# Altium schematic sheet main.SchDoc: Top Level
size A4; DrawnBy: J. Reimer T. Yeung M. Hirole; Organization: UTAT SS; DocumentNumber: 1; Revision: 1.0; SheetNumber: 1; SheetTotal: 17
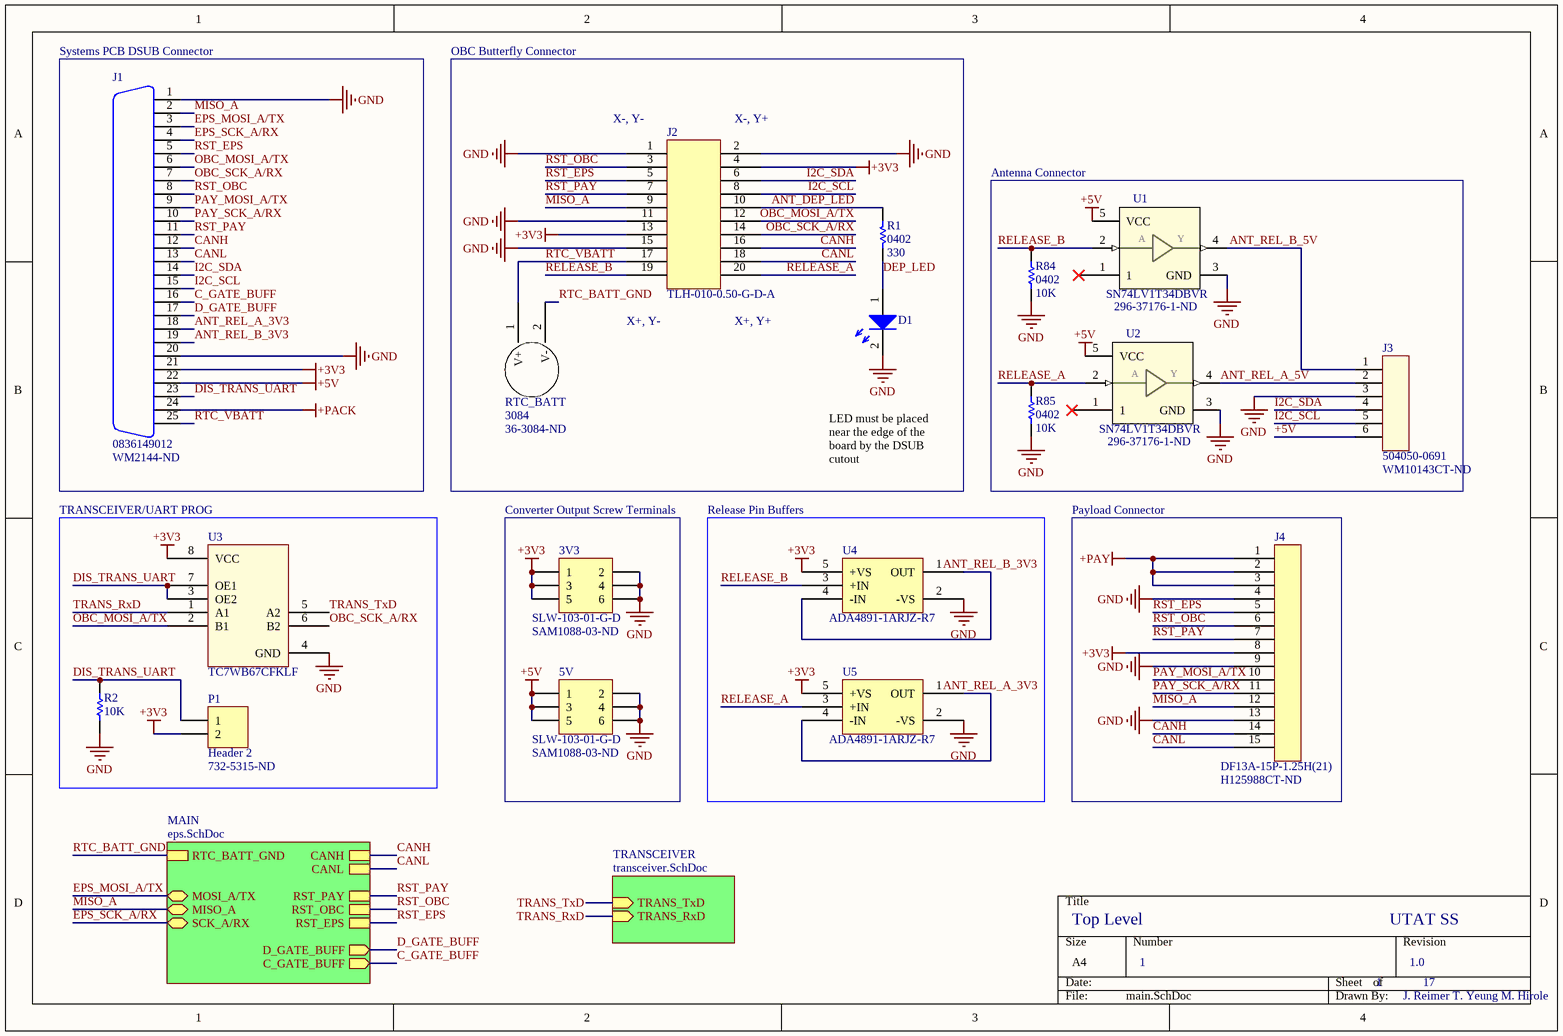
[diagram p0: main.SchDoc]

## Parts
3V3  SLW-103-01-G-D  Supplier Part Number 1: SAM1088-03-ND  [SLW-103-01-X-D]
5V  SLW-103-01-G-D  Supplier Part Number 1: SAM1088-03-ND  [SLW-103-01-X-D]
D1  (no value)  [LED0603]
J1  0836149012  Supplier Part Number 1: WM2144-ND  [0836149012]
J2  TLH-010-0.50-G-D-A  [TLH-010-0.50-G-D-A]
J3  504050-0691  Supplier Part Number 1: WM10143CT-ND  [MOLEX_504050-0691]
J4  DF13A-15P-1.25H(21)  Supplier Part Number 1: H125988CT-ND  [DF13A-15P-1.25H(21)]
P1  Header 2  Supplier Part Number 1: 732-5315-ND  [HDR1X2]
R1  0402  value 330  [RES0402R]
R2  value 10K  [RES0402R]  (hidden comment: 0402)
R84  0402  value 10K  [RES0402R]
R85  0402  value 10K  [RES0402R]
RTC_BATT  3084  Supplier Part Number 1: 36-3084-ND  [3084]
U1  SN74LV1T34DBVR  Supplier Part Number 1: 296-37176-1-ND  [SOT95P280X145-5N]
U2  SN74LV1T34DBVR  Supplier Part Number 1: 296-37176-1-ND  [SOT95P280X145-5N]
U3  TC7WB67CFKLF  [US8]
U4  ADA4891-1ARJZ-R7  [SOT-23-5]
U5  ADA4891-1ARJZ-R7  [SOT-23-5]

## Blocks framed on the sheet
Systems PCB DSUB Connector: J1
Antenna Connector: J3 R84 R85 U1 U2
TRANSCEIVER/UART PROG: P1 R2 U3
Converter Output Screw Terminals: 3V3 5V
Release Pin Buffers: U4 U5
Payload Connector: J4

## Sub-sheets
MAIN = eps.SchDoc: RST_PAY, RST_OBC, RST_EPS, SCK_A/RX (bidir), MOSI_A/TX (bidir), MISO_A (bidir), CANL, CANH, RTC_BATT_GND, D_GATE_BUFF (out), C_GATE_BUFF (out)
TRANSCEIVER = transceiver.SchDoc: TRANS_RxD (in), TRANS_TxD (in)

## Nets
+3V3: 3V3.1 3V3.3 3V3.5 J1.21 J2.4 J2.13 J4.8 P1.2 U3.8(VCC) U4.5(+VS) U5.5(+VS)
+5V: 5V.1 5V.3 5V.5 J1.22 J3.6 U1.5(VCC) U2.5(VCC)
+PACK: J1.24
+PAY: J4.1 J4.2 J4.3
GND: 3V3.2 3V3.4 3V3.6 5V.2 5V.4 5V.6 D1.2 J1.1 J1.20 J2.1 J2.2 J2.11 J2.15 J3.3 J4.4 J4.9 J4.13 R2.2 R84.1 R85.1 U1.3(GND) U2.3(GND) U3.4(GND) U4.2(-VS) U5.2(-VS)
ANT_DEP_LED: J2.10 R1.2
ANT_REL_A_3V3: J1.18 U5.1(OUT) U5.4(-IN)
ANT_REL_A_5V: J3.2 U2.4(Y)
ANT_REL_B_3V3: J1.19 U4.1(OUT) U4.4(-IN)
ANT_REL_B_5V: J3.1 U1.4(Y)
C_GATE_BUFF: J1.16 ; sheet MAIN/C_GATE_BUFF
CANH: J1.12 J2.16 J4.14 ; sheet MAIN/CANH
CANL: J1.13 J2.18 J4.15 ; sheet MAIN/CANL
D_GATE_BUFF: J1.17 ; sheet MAIN/D_GATE_BUFF
DEP_LED: D1.1 R1.1
DIS_TRANS_UART: J1.23 P1.1 R2.1 U3.3(OE2) U3.7(OE1)
EPS_MOSI_A/TX: J1.3 ; sheet MAIN/MOSI_A/TX
EPS_SCK_A/RX: J1.4 ; sheet MAIN/SCK_A/RX
I2C_SCL: J1.15 J2.8 J3.5
I2C_SDA: J1.14 J2.6 J3.4
MISO_A: J1.2 J2.9 J4.12 ; sheet MAIN/MISO_A
OBC_MOSI_A/TX: J1.6 J2.12 U3.2(B1)
OBC_SCK_A/RX: J1.7 J2.14 U3.6(B2)
PAY_MOSI_A/TX: J1.9 J4.10
PAY_SCK_A/RX: J1.10 J4.11
RELEASE_A: J2.20 R85.2 U2.2(A) U5.3(+IN)
RELEASE_B: J2.19 R84.2 U1.2(A) U4.3(+IN)
RST_EPS: J1.5 J2.5 J4.5 ; sheet MAIN/RST_EPS
RST_OBC: J1.8 J2.3 J4.6 ; sheet MAIN/RST_OBC
RST_PAY: J1.11 J2.7 J4.7 ; sheet MAIN/RST_PAY
RTC_BATT_GND: RTC_BATT.2(V-) ; sheet MAIN/RTC_BATT_GND
RTC_VBATT: J1.25 J2.17 RTC_BATT.1(V+)
TRANS_RxD: U3.1(A1) ; sheet TRANSCEIVER/TRANS_RxD
TRANS_TxD: U3.5(A2) ; sheet TRANSCEIVER/TRANS_TxD

Not connected (* = marked no-connect by the designer): U1 1*; U2 1*

## Notes on the sheet
- OBC Butterfly Connector
- (near J2) X-, Y-
- (near J2) X-, Y+
- (near J2) X+, Y-
- (near J2) X+, Y+
- LED must be placed near the edge of the board by the DSUB cutout

## Library data of the parts
3V3 5V = SLW-103-01-G-D: 6 pos 100mil pitch low profile header; Supplier 1: Digi-Key
D1 = LED: Just a generic LED
J1 = 0836149012: Mini-DSUB 25-pos Connector; Supplier 1: Digi-Key
J2 = TLH-010-0.50-G-D-A: 0.50 mm Razor Beam LP Ultra Low Profile Terminal Strip, alignment pin option; Supplier 1: Samtec; ComponentLink1Description: Product Page; ComponentLink1URL: https://www.samtec.com/products/tlh-010-0.50-g-d-a; Supplier Part Number 1: TLH-010-0.50-G-D-A
J3 = 504050-0691: Wire-To-Board Connector, Pico-Lock 504050 Series, Surface Mount, Header, 6, 1.5 mm; Supplier 1: Digi-Key
J4 = DF13A-15P-1.25H(21): 15 pos DF13 right angle surface mount connector; Supplier 1: Digi-Key
P1 = Header 2: Header, 2-Pin; LatestRevisionDate: 17-Jul-2002; LatestRevisionNote: Re-released for DXP Platform.; Publisher: Altium Limited; Supplier 1: Digi-Key
R1 R2 R84 R85 = RES0402: 0402 resistor
RTC_BATT = 3084: CR2330 Battery Holder; Manufacturer: Keystone Electronics; Number of Batteries: 2; Number of Cells: 1; Supplier 1: Digi-Key; Manufacturer Part Number: 3084; Stock 1: 658; Pricing 1: 1=0.62, 10=0.523, 50=0.4586, 250=0.39796, 500=0.391, 1000=0.34946, 2500=0.31916, 5000=0.29492 (USD); Mount: Surface Mount,PCB; Case/Package: SMD/SMT; Package Quantity: 100; Termination: SMD/SMT; Lead Free: Lead Free; REACH SVHC: No SVHC; ComponentLink1URL: http://media.digikey.com/pdf/Data%20Sheets/Keystone%20Electronics%20PDFs/Lithium_Coin_Cell_Retainers_SMT.pdf?src-supplier=Digi-Key; ComponentLink1Description: http://media.digikey.com/pdf/Data%20Sheets/Keystone%20Electronics%20PDFs/Lithium_Coin_Cell_Retainers_SMT.pdf?src-supplier=Digi-Key
U1 U2 = SN74LV1T34DBVR: Single Power Supply BUFFER Logic Level Shifter _no enable_ 5-SOT-23 -40 to 125; MF: Texas Instruments; Number of Elements: 1; Logic Function: Buffer,Inverting; Max Supply Voltage: 5.5V; Min Supply Voltage: 1.6V; High Level Output Current: -8mA; Low Level Output Current: 8mA; Polarity: Non-Inverting; Propagation Delay: 15.5ns; Quiescent Current: 1uA; SnapEDA_Link: https://www.snapeda.com/parts/SN74LV1T34DBVR/Texas%20Instruments/view-part/?ref=snap; MP: SN74LV1T34DBVR; Package: SOT-23 Texas Instruments; Digi-Key_Purchase_URL: https://www.digikey.ca/product-detail/en/texas-instruments/SN74LV1T34DBVR/296-37176-1-ND/4555593?utm_source=snapeda&utm_medium=aggregator&utm_campaign=symbol; Digi-Key_Part_Number: 296-37176-1-ND; Value: *; Supplier 1: Digi-Key; Manufacturer: Texas Instruments; Manufacturer Part Number: SN74LV1T34DBVR; Stock 1: 39936; Pricing 1: 1=0.47, 10=0.378, 100=0.2571, 500=0.19282, 1000=0.14461 (USD); Mount: Surface Mount; Case/Package: SOT-23-5; Number of Pins: 5; Weight: 0.000353oz; Min Operating Temperature: -40°C; Max Operating Temperature: 125°C; Package Quantity: 3000; Packaging: Tape and Reel; Number of Bits per Element: 1; Number of Input Lines: 1; Number of Output Lines: 1; Operating Supply Current: 8mA; Number of Channels: 1; Number of Inputs: 1; Number of Outputs: 1; Number of Bits: 1; Radiation Hardening: No; REACH SVHC: No SVHC; Lead Free: Lead Free; ComponentLink1URL: http://www.ti.com/lit/pdf/sdyu001?src-supplier=Digi-Key; ComponentLink1Description: http://www.ti.com/lit/pdf/sdyu001?src-supplier=Digi-Key; ComponentLink2URL: http://www.ti.com/lit/ds/symlink/sn74lv1t34.pdf?src-supplier=Avnet; ComponentLink2Description: http://www.ti.com/lit/ds/symlink/sn74lv1t34.pdf?src-supplier=Avnet
U3 = TC7WB66CFKLF: Active high bus switch; Manufacturer: Toshiba; Manufacturer Part Number: TC7WB67CFK,LF(CT; Supplier 1: Digi-Key; Supplier 2: Digi-Key; Stock 2: 5593; Pricing 2: 1=0.41, 10=0.32, 25=0.27, 100=0.2199, 250=0.1822, 500=0.1508, 1000=0.11309 (USD); Supplier Part Number 2: TC7WB67CFKLF(CTCT-ND
U4 U5 = ADA4891-1ARJZ-R7: Rail-to-rail amplifier 125mA max; Vendor: Analog Devices Inc; Built_By: EMA_UL_Team; Manufacturer_Part_Number: ADA4891-1ARJZ-R7; Copyright: Copyright (C) 2018 Accelerated Designs. All rights reserved; RefDes: RefDes; Type: DEV; Value: Value; Supplier 1: Digi-Key; Supplier Part Number 1: ADA4891-1ARJZ-R7CT-ND